# EasyEDA schematic SCH_Glowing_Heart_2025-11-25.json
REV: 1.0; Date: 2025-11-20; Sheet: 1/1; Drawn By: arek.stasko; Company: Your Company
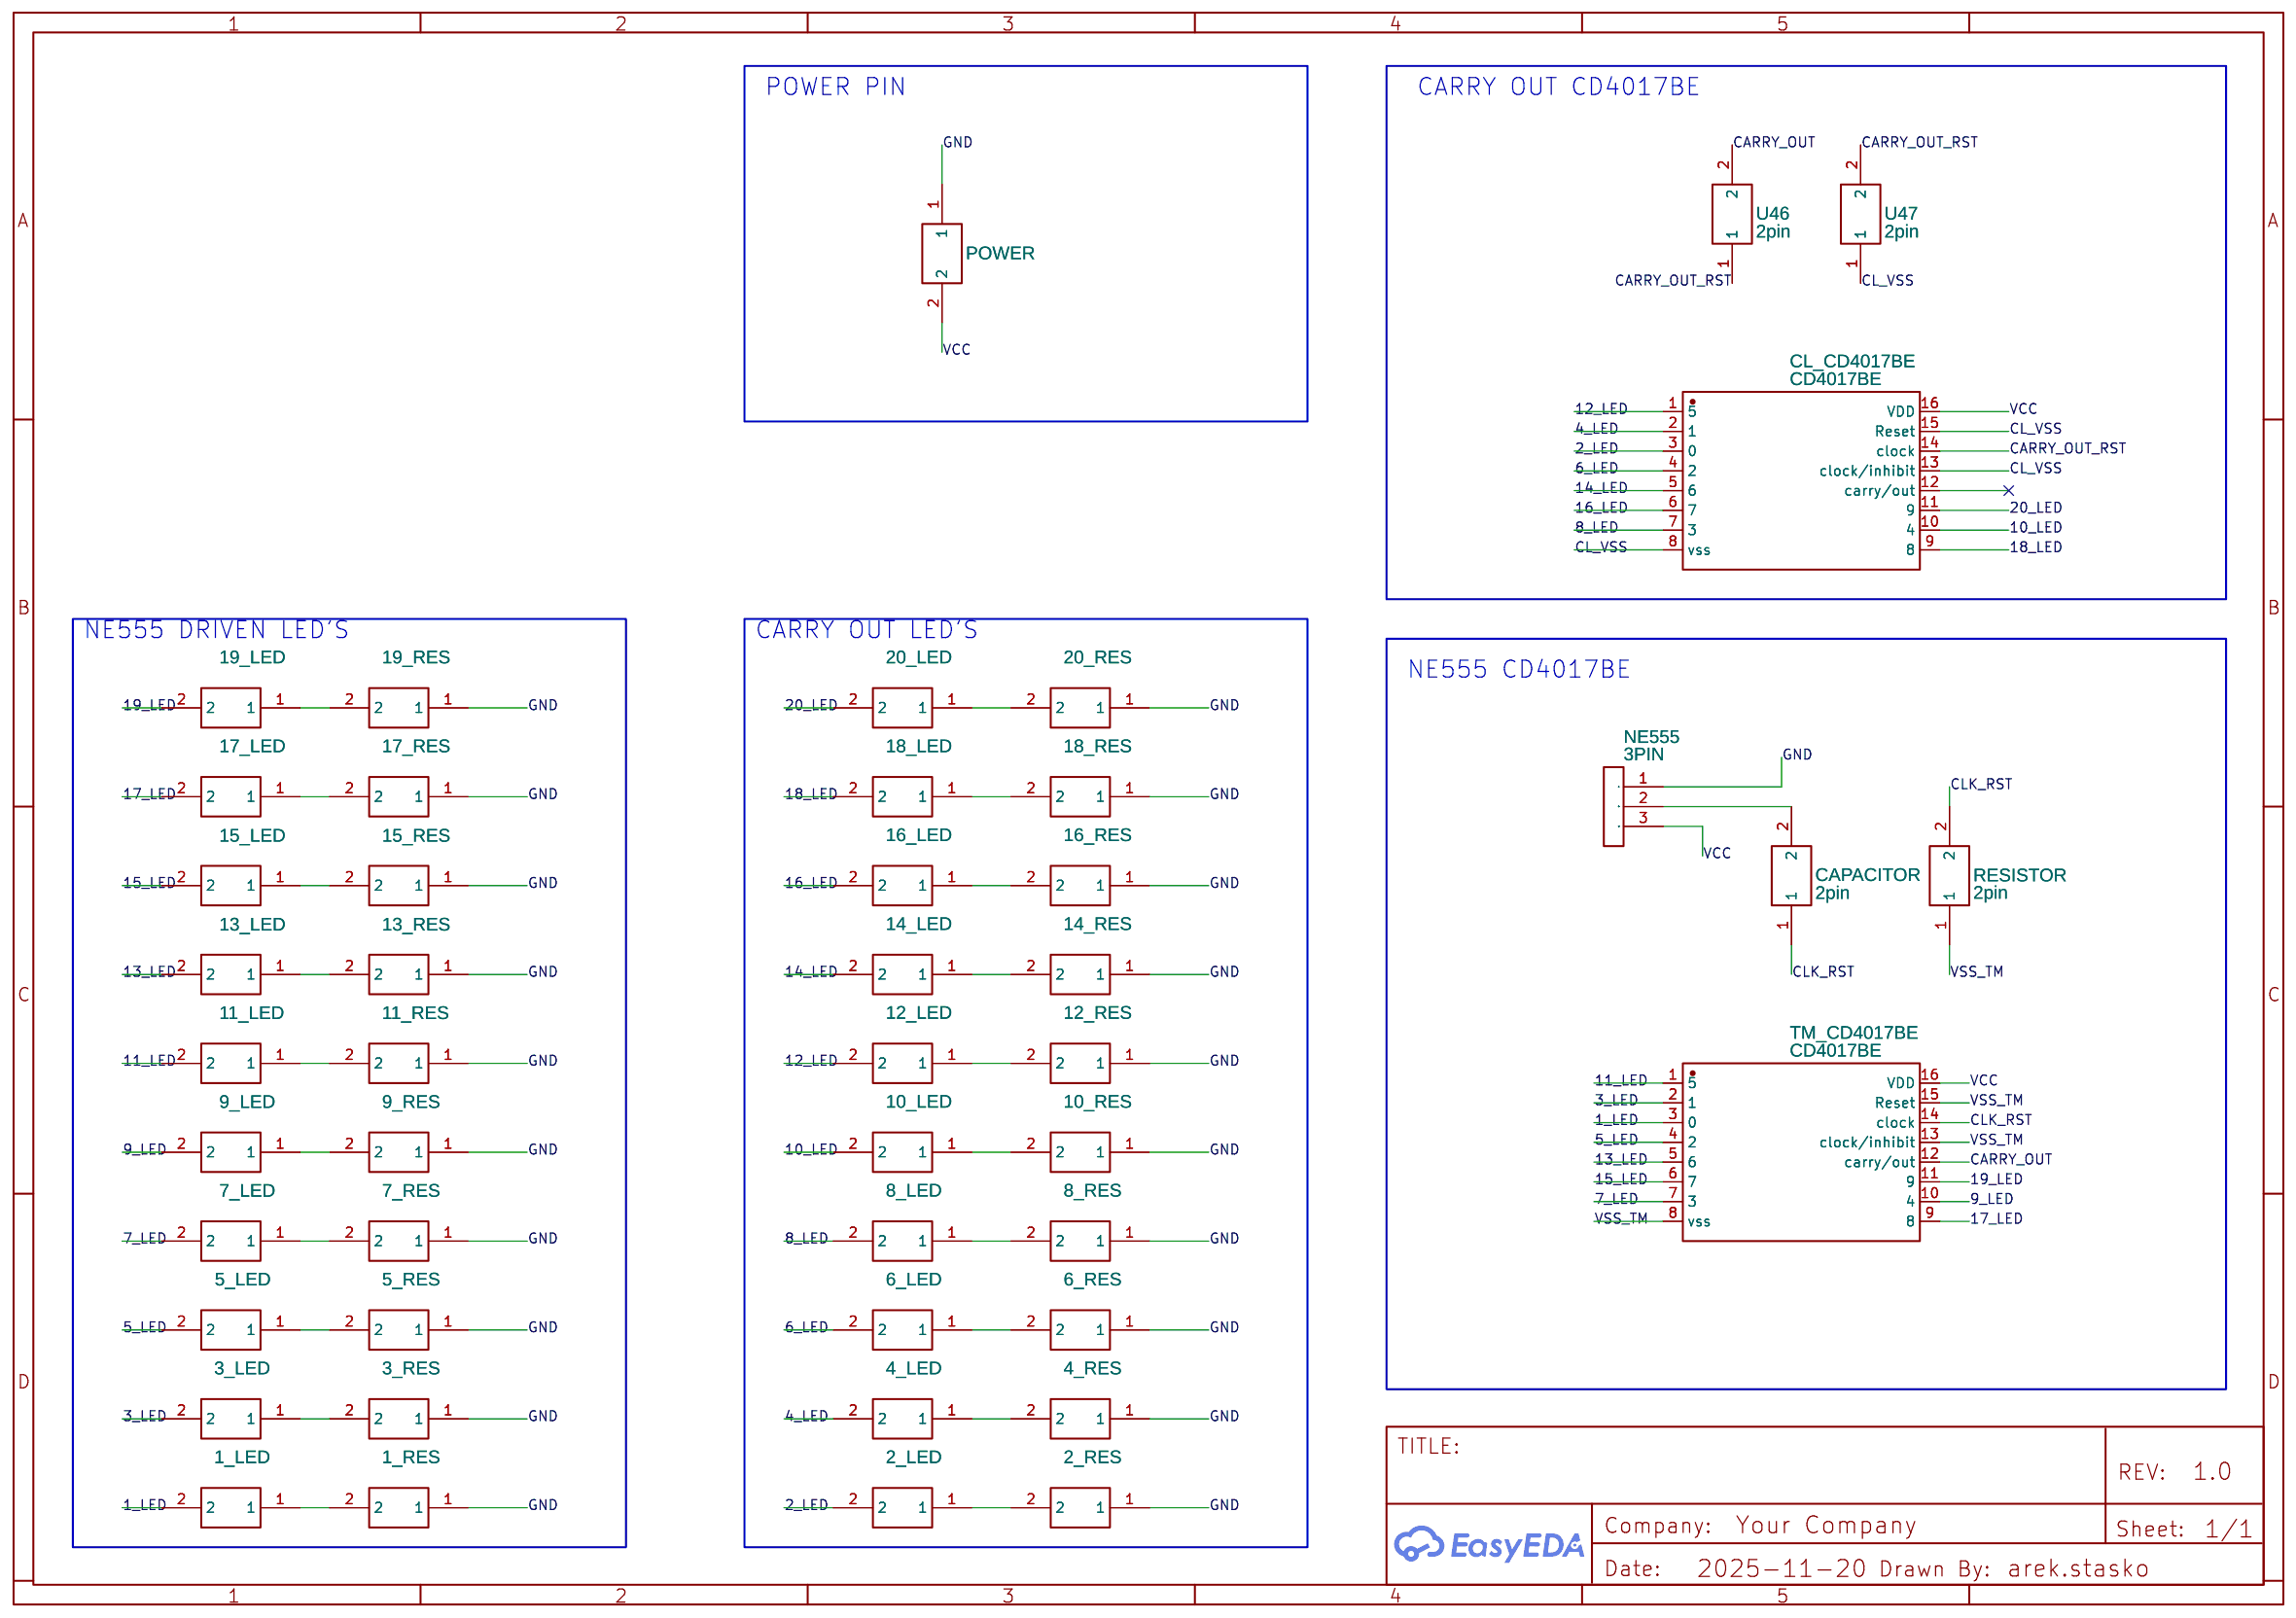
[diagram p0: schematic sheet]

## Parts
1_LED  2pin  [2PINS]
1_RES  2pin  [2PINS]
2_LED  2pin  [2PINS]
2_RES  2pin  [2PINS]
3_LED  2pin  [2PINS]
3_RES  2pin  [2PINS]
4_LED  2pin  [2PINS]
4_RES  2pin  [2PINS]
5_LED  2pin  [2PINS]
5_RES  2pin  [2PINS]
6_LED  2pin  [2PINS]
6_RES  2pin  [2PINS]
7_LED  2pin  [2PINS]
7_RES  2pin  [2PINS]
8_LED  2pin  [2PINS]
8_RES  2pin  [2PINS]
9_LED  2pin  [2PINS]
9_RES  2pin  [2PINS]
10_LED  2pin  [2PINS]
10_RES  2pin  [2PINS]
11_LED  2pin  [2PINS]
11_RES  2pin  [2PINS]
12_LED  2pin  [2PINS]
12_RES  2pin  [2PINS]
13_LED  2pin  [2PINS]
13_RES  2pin  [2PINS]
14_LED  2pin  [2PINS]
14_RES  2pin  [2PINS]
15_LED  2pin  [2PINS]
15_RES  2pin  [2PINS]
16_LED  2pin  [2PINS]
16_RES  2pin  [2PINS]
17_LED  2pin  [2PINS]
17_RES  2pin  [2PINS]
18_LED  2pin  [2PINS]
18_RES  2pin  [2PINS]
19_LED  2pin  [2PINS]
19_RES  2pin  [2PINS]
20_LED  2pin  [2PINS]
20_RES  2pin  [2PINS]
CAPACITOR  2pin  [2PINS]
CL_CD4017BE  CD4017BE  [CD4017BE]
NE555  3PIN  [3PIN]
POWER  2pin  [2PINS]
RESISTOR  2pin  [2PINS]
TM_CD4017BE  CD4017BE  [CD4017BE]
U46  2pin  [2PINS]
U47  2pin  [2PINS]

## Library data of the parts
1_LED 1_RES 2_LED 2_RES 3_LED 3_RES 4_LED 4_RES 5_LED 5_RES 6_LED 6_RES 7_LED 7_RES 8_LED 8_RES 9_LED 9_RES 10_LED 10_RES 11_LED 11_RES 12_LED 12_RES 13_LED 13_RES 14_LED 14_RES 15_LED 15_RES 16_LED 16_RES 17_LED 17_RES 18_LED 18_RES 19_LED 19_RES 20_LED 20_RES CAPACITOR POWER RESISTOR U46 U47 = 2pin: Supplier: kascada; Contributor: KaScada
CL_CD4017BE TM_CD4017BE = CD4017BE: Supplier: texas instrument; Contributor: camilofuegos
NE555 = 3PIN: Contributor: sfenel

## Nets
GND: 1_RES.1 2_RES.1 3_RES.1 4_RES.1 5_RES.1 6_RES.1 7_RES.1 8_RES.1 9_RES.1 10_RES.1 11_RES.1 12_RES.1 13_RES.1 14_RES.1 15_RES.1 16_RES.1 17_RES.1 18_RES.1 19_RES.1 20_RES.1 NE555.1 POWER.1
VCC: CL_CD4017BE.16(VDD) NE555.3 POWER.2 TM_CD4017BE.16(VDD)
VSS_TM: RESISTOR.1 TM_CD4017BE.8(vss) TM_CD4017BE.13(clock/inhibit) TM_CD4017BE.15(Reset)
1_LED: 1_LED.2 TM_CD4017BE.3(0)
2_LED: 2_LED.2 CL_CD4017BE.3(0)
3_LED: 3_LED.2 TM_CD4017BE.2(1)
4_LED: 4_LED.2 CL_CD4017BE.2(1)
5_LED: 5_LED.2 TM_CD4017BE.4(2)
6_LED: 6_LED.2 CL_CD4017BE.4(2)
7_LED: 7_LED.2 TM_CD4017BE.7(3)
8_LED: 8_LED.2 CL_CD4017BE.7(3)
9_LED: 9_LED.2 TM_CD4017BE.10(4)
10_LED: 10_LED.2 CL_CD4017BE.10(4)
11_LED: 11_LED.2 TM_CD4017BE.1(5)
12_LED: 12_LED.2 CL_CD4017BE.1(5)
13_LED: 13_LED.2 TM_CD4017BE.5(6)
14_LED: 14_LED.2 CL_CD4017BE.5(6)
15_LED: 15_LED.2 TM_CD4017BE.6(7)
16_LED: 16_LED.2 CL_CD4017BE.6(7)
17_LED: 17_LED.2 TM_CD4017BE.9(8)
18_LED: 18_LED.2 CL_CD4017BE.9(8)
19_LED: 19_LED.2 TM_CD4017BE.11(9)
20_LED: 20_LED.2 CL_CD4017BE.11(9)
CARRY_OUT: TM_CD4017BE.12(carry/out) U46.2
CARRY_OUT_RST: CL_CD4017BE.14(clock) U46.1 U47.2
CL_VSS: CL_CD4017BE.8(vss) CL_CD4017BE.13(clock/inhibit) CL_CD4017BE.15(Reset) U47.1
CLK_RST: CAPACITOR.1 RESISTOR.2 TM_CD4017BE.14(clock)
Net-(1_LED-1): 1_LED.1 1_RES.2
Net-(2_LED-1): 2_LED.1 2_RES.2
Net-(3_LED-1): 3_LED.1 3_RES.2
Net-(4_LED-1): 4_LED.1 4_RES.2
Net-(5_LED-1): 5_LED.1 5_RES.2
Net-(6_LED-1): 6_LED.1 6_RES.2
Net-(7_LED-1): 7_LED.1 7_RES.2
Net-(8_LED-1): 8_LED.1 8_RES.2
Net-(9_LED-1): 9_LED.1 9_RES.2
Net-(10_LED-1): 10_LED.1 10_RES.2
Net-(11_LED-1): 11_LED.1 11_RES.2
Net-(12_LED-1): 12_LED.1 12_RES.2
Net-(13_LED-1): 13_LED.1 13_RES.2
Net-(14_LED-1): 14_LED.1 14_RES.2
Net-(15_LED-1): 15_LED.1 15_RES.2
Net-(16_LED-1): 16_LED.1 16_RES.2
Net-(17_LED-1): 17_LED.1 17_RES.2
Net-(18_LED-1): 18_LED.1 18_RES.2
Net-(19_LED-1): 19_LED.1 19_RES.2
Net-(20_LED-1): 20_LED.1 20_RES.2
Net-(CAPACITOR-2): CAPACITOR.2 NE555.2

Not connected (* = marked no-connect by the designer): CL_CD4017BE 12(carry/out)

## Notes on the sheet
- POWER PIN
- CARRY OUT CD4017BE
- NE555 DRIVEN LED'S
- CARRY OUT LED'S
- NE555 CD4017BE
